# Altium schematic sheet 03-Power.SchDoc
size A
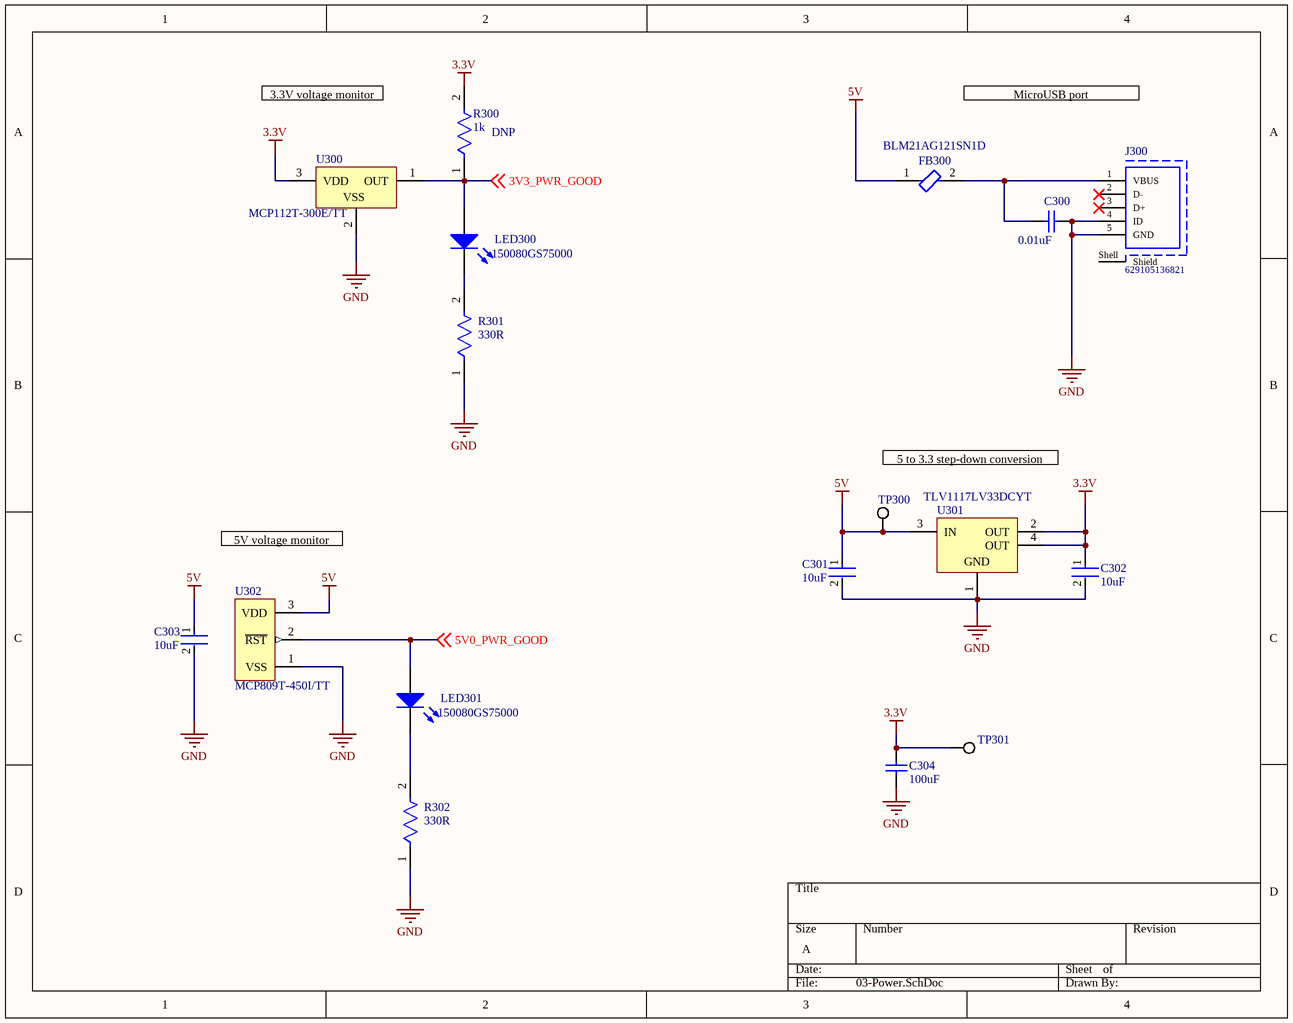
[diagram p0: 03-Power.SchDoc]

## Parts
C300  0.01uF  [CAPC2013X88X50LL20T25]
C301  10uF  [FP-GRM21B-0_1-IPC_B]
C302  10uF  [FP-GRM21B-0_1-IPC_B]
C303  10uF  [FP-GRM21B-0_1-IPC_B]
C304  100uF  [CAPC3216X190X55ML30T25]
FB300  BLM21AG121SN1D  [FP-BLM21-0_2-t0_85-e0_5-IPC_A]
J300  629105136821  [629105136821]
LED300  150080GS75000  [0805_A]
LED301  150080GS75000  [0805_A]
R300  1k  [FP-ERA6A-IPC_C]
R301  330R  [FP-ERA3A-MFG]
R302  330R  [FP-ERA3A-MFG]
TP300  5019  [KSTN-5019_V]  (value not drawn)
TP301  5019  [KSTN-5019_V]  (value not drawn)
U300  MCP112T-300E/TT  [SOT-23-TT3_L]
U301  TLV1117LV33DCYT  [DCY0004A_M]
U302  MCP809T-450I/TT  [SOT-23-TT3_N]

## Nets
3.3V: C302.1 C304.2 R300.2 TP301.1 U300.3(VDD) U301.2(OUT) U301.4(OUT)
5V: C301.1 C303.1 FB300.1 TP300.1 U301.3(IN) U302.3(VDD)
GND: C300.2 C301.2 C302.2 C303.2 C304.1 J300.4(ID) J300.5(GND) R301.1 R302.1 U300.2(VSS) U301.1(GND) U302.1(VSS)
3V3_PWR_GOOD: LED300.2(A) R300.1 U300.1(OUT) ; off-sheet 3V3_PWR_GOOD
5V0_PWR_GOOD: LED301.2(A) U302.2(~{RST}) ; off-sheet 5V0_PWR_GOOD
NetC300_1: C300.1 FB300.2 J300.1(VBUS)
NetLED300_1: LED300.1(K) R301.2
NetLED301_1: LED301.1(K) R302.2

Not connected (* = marked no-connect by the designer): J300 2(D-)* 3(D+)* Shell(Shield)

## Notes on the sheet
- 3.3V voltage monitor
- MicroUSB port
- (near R300) DNP
- 5 to 3.3 step-down conversion
- 5V voltage monitor

## Library data of the parts
C300 = CMP-2007-00266-1: Manufacturer: Kemet; Part Number: C0805C103K5RACTU; Capacitance: 10nF; Tolerance: 10%; Voltage Rating (DC): 50V; Dielectric: X7R; Supplier 1: Digi-Key; Supplier 2: Digi-Key; Manufacturer Part Number: C0805C103K5RACTU; RoHS: Yes; Category: Ceramic Capacitors; Stock 2: 3220156; Pricing 2: 1=0.11000, 10=0.07500, 50=0.04260, 100=0.03530, 500=0.02476, 1000=0.02050 (USD); Mount: Surface Mount; Case/Package: 0805; Case Code (Imperial): 0805; Case Code (Metric): 2012; Contact Plating: Tin,Matte; Min Operating Temperature: -55°C; Max Operating Temperature: 125°C; Packaging: Tape and Reel; Package Quantity: 4000; Voltage Rating: 50V; Termination: SMD/SMT; Voltage: 50V; Construction: Flat; Length: 2mm; Width: 1.2mm; Height: 0.78mm; Lead Pitch: 0.75mm; Depth: 1.25mm; Radiation Hardening: No; ComponentLink1URL: http://www.farnell.com/datasheets/2740682.pdf?src-supplier=Farnell; ComponentLink1Description: http://www.farnell.com/datasheets/2740682.pdf?src-supplier=Farnell; ComponentLink2URL: http://www.onlinecomponents.com/productFiles/mf-KEM/kem_c1002_x7r_smd.pdf?src-supplier=Onlinecomponents.com; ComponentLink2Description: http://www.onlinecomponents.com/productFiles/mf-KEM/kem_c1002_x7r_smd.pdf?src-supplier=Onlinecomponents.com; ComponentLink3URL: https://www.verical.com/server-webapp/html/getDatasheet?partID=293414&src-supplier=Verical; ComponentLink3Description: https://www.verical.com/server-webapp/html/getDatasheet?partID=293414&src-supplier=Verical; ComponentLink4URL: http://www.farnell.com/datasheets/2740682.pdf?src-supplier=Newark; ComponentLink4Description: http://www.farnell.com/datasheets/2740682.pdf?src-supplier=Newark; ComponentLink5URL: http://www.farnell.com/datasheets/2740682.pdf?src-supplier=Element14; ComponentLink5Description: http://www.farnell.com/datasheets/2740682.pdf?src-supplier=Element14; ComponentLink6URL: https://api.kemet.com/component-edge/download/datasheet/C0805C103K5RACTU.pdf?src-supplier=Digi-Key; ComponentLink6Description: https://api.kemet.com/component-edge/download/datasheet/C0805C103K5RACTU.pdf?src-supplier=Digi-Key; ComponentLink7URL: http://www.kemet.com/Lists/ProductCatalog/Attachments/53/KEM_C1002_X7R_SMD.pdf?src-supplier=Avnet; ComponentLink7Description: http://www.kemet.com/Lists/ProductCatalog/Attachments/53/KEM_C1002_X7R_SMD.pdf?src-supplier=Avnet
C301-C303 = CMP-2007-03503-2: Chip Multilayer Ceramic Capacitors for General Purpose, 0805, 10uF, X6S, 22%, 10%, 16V; Capacitance: 10uF; Termination: SMD/SMT; Min Operating Temperature: -55°C; REACH SVHC: No SVHC; Voltage: 16V; Thickness: 0.053inch; Voltage Rating (DC): 16V; Lead Free: Lead Free; Tolerance: 10%; Packaging: Tape and Reel; Package Quantity: 3000; Max Operating Temperature: 105°C; Height: 1.25mm; Case Code (Metric): 2012; Case Code (Imperial): 0805; Dielectric: X6S; Weight: 0.000335oz; Depth: 1.25mm; Width: 0.049inch; Voltage Rating: 16V; Case/Package: 0805; Mount: Surface Mount; Length: 2mm
C304 = CMP-1662-00011-2: Chip Capacitor, 100 uF, +/- 20%, 6.3 V, -55 to 85 degC, 1206 (3216 Metric), RoHS, Tape and Reel; PartNumber: GRM31CR60J107ME39L; Case\/Package: 1206; Voltage Rating (DC): 6.3 V; Type (Capacitors): X5R; REACH SVHC: No SVHC; Height: 1.6 mm; Tolerance: 20%; Packaging: Tape and Reel; Mount: Surface Mount; PackageDescription: 2-Pin Surface Mount Device, Body 3.2 x 1.6 mm; ComponentLink1URL: http://www.murata.com/; Pins: 2; ComponentLink2Description: Datasheet; PackageReference: 1206; Width: 1.6 mm; Package Quantity: 2000; Capacitance: 100 uF; Min Operating Temperature: -55 degC; Case Code (Imperial): 1206; Max Operating Temperature: 85 degC; DatasheetVersion: 09/2016; Mounting Technology: Surface Mount; Voltage Rating: 6.3 V; ComponentLink1Description: Manufacturer URL; Radiation Hardening: No; Case Code (Metric): 3216; Length: 3.2 mm; ComponentLink2URL: http://psearch.en.murata.com/capacitor/product/GRM31CR60J107ME39%23.pdf; RoHSCompliant: true
FB300 = CMP-0686-00716-3: FERRITE BEAD 120 OHM 0805 1LN; Number of Lines: 1; DC Resistance-Max: 100mR; Material: Steel; Max DC Current: 200mA; Shielding: Unshielded; Test Frequency: 100MHz; Impedance: 120R; Current Rating: 800mA; Max Current Rating: 1A; Resistance: 150mR; Tolerance: 25%; Width: 1.25mm; Number of Circuits: 1; Military Standard: Not; Height: 0.85mm; Series: BLM21A; Min Operating Temperature: -55°C; DC Resistance (DCR): 100mR; Termination: SMD/SMT; Core Material: Ferrite; REACH SVHC: No SVHC; Radiation Hardening: No; Max Operating Temperature: 125°C; Number of Pins: 2; Case/Package: 0805; Case Code (Imperial): 0805; Frequency: 100MHz; Depth: 1.25mm; Length: 2mm; DC Current: 200mA; Lead Free: Lead Free; Case Code (Metric): 2012; Package Quantity: 1; Packaging: Tape and Reel
J300 = CMP-1502-03253-1: Micro USB 2.0 Type B Receptacle WR-COM, Horizontal, SMT, with Pads and Pegs; Manufacturer: Wurth Elektronik; Contact Resistance: 30mOhm; Rated Current: 1A; Working Voltage: 30VAC; Datasheet URL: https://katalog.we-online.de/em/datasheet/629105136821.pdf; Mounting Technology: SMT; Publisher: WurthElektronik; Package Reference: 629105136821; Orientation: Horizontal; Packaging: TapeandReel; Part Number: 629105136821; Manufacturer URL: http://www.we-online.de; Connector Type: MicroUSB2.0TypeB; Gender: Receptacle; Operating Temperature: -40to105degC
LED300 LED301 = CMP-1426-00007-1: SMD mono-color Chip LED, WL-SMCW, Green; Manufacturer: Wuerth Elektronik; PackageReference: 0805_A; Color: Green; PartNumber: 150080GS75000; ComponentLink2URL: http://katalog.we-online.com/led/datasheet/150080GS75000.pdf; ComponentLink1URL: http://www.we-online.com; ComponentLink1Description: Manufacturer URL; ComponentLink2Description: Datasheet
R300 = CMP-2001-00581-2: RES 1K OHM 0.1% 1/8W 0805; Temperature Coefficient: 25ppm/°C; Resistance: 1kR; Working Voltage: 100V; Max Power Dissipation: 125mW; Height: 0.5mm; Technology: THIN FILM; REACH SVHC: No SVHC; Packaging: Tape and Reel; Length: 2mm; Width: 1.25mm; Resistance Tolerance: 0.1%; Series: ERA-6A; Resistor Type: Thin Film; Number of Pins: 2; Case Code (Metric): 2012; Voltage Rating: 100V; Radiation Hardening: No; Construction: Rectangular; Mount: Surface Mount; Number of Terminations: 2; Case/Package: 0805; Min Operating Temperature: -55°C; Military Standard: Not; RoHS Compliant: Yes; Termination: SMD/SMT; Case Code (Imperial): 0805; Depth: 1.25mm; Power Rating: 125mW; Max Operating Temperature: 155°C; Contact Plating: Tin; Package Quantity: 5000; Tolerance: 0.1%
R301 R302 = CMP-2000-00036-2: RES SMD 330 OHM 0.1% 1/10W 0603; Power Rating: 100mW; Temperature Coefficient: 25ppm/°C; Voltage Rating: 75V; Package Quantity: 1; Case Code (Metric): 1608; Size Code: 0603; Construction: Rectangular; Width: 0.8mm; Number of Pins: 2; Case/Package: 0603; Height: 0.45mm; Resistor Type: Thin Film; Resistance: 330R; RoHS Compliant: Yes; Contact Plating: Tin; Case Code (Imperial): 0603; Number of Terminations: 2; Tolerance: 0.1%; Min Operating Temperature: -55°C; Mount: Surface Mount; Length: 1.6mm; Packaging: Tape and Reel; Resistance Tolerance: 0.1%; Military Standard: Not; Reach SVHC Compliant: Yes; Max Operating Temperature: 155°C; Features: Automotive AEC-Q200; Termination: SMD/SMT; Max Power Dissipation: 100mW; Radiation Hardening: No; Depth: 0.8mm; Series: ERA-3A; Technology: METAL FILM
TP300 TP301 = CMP-1672-00008-1: Test Point, 1 Position SMD, RoHS, Tape and Reel; Manufacturer 1: Keystone Electronics; ComponentLink1Description: Manufacturer URL; Package Quantity: 1000; DatasheetVersion: 03/2014; Packaging: Tape and Reel; ComponentLink2URL: http://www.keyelco.com/product-pdf.cfm?p=1357; ComponentLink1URL: http://www.keyelco.com/; Mount: Surface Mount; Contact Plating: Silver; PackageDescription: 1-Pin Surface Mount Device, Body 3.81 x 2.03 mm; Pins: 1; RoHSCompliant: True; Mounting Technology: Surface Mount; ComponentLink2Description: Datasheet; PackageReference: 5019; Supplier 1: Digi-Key; Supplier Part Number 1: 36-5019CT-ND; Manufacturer Part Number 1: 5019; RoHS: Yes; Category: Connectors; Stock 1: 1316816; Pricing 1: 1=0.34000, 25=0.27360, 100=0.22340, 250=0.20064, 500=0.19152 (USD); Number of Pins: 1; Material: Bronze; Contact Material: Bronze; Series: 5019; Termination: SMD/SMT; Height: 0.09inch; RoHS Compliant: Yes; REACH SVHC: No SVHC; Lead Free: Lead Free; ComponentLink3URL: https://datasheet.ciiva.com/16318/m60-2p61-16318395.pdf?src-supplier=Future+Electronics; ComponentLink3Description: https://datasheet.ciiva.com/16318/m60-2p61-16318395.pdf?src-supplier=Future+Electronics; ComponentLink4URL: https://datasheet.ciiva.com/16885/70182998-16885945.pdf?src-supplier=Allied+Electronics; ComponentLink4Description: https://datasheet.ciiva.com/16885/70182998-16885945.pdf?src-supplier=Allied+Electronics; ComponentLink5URL: https://datasheet.ciiva.com/14848/m60-2p61-14848437.pdf?src-supplier=Digi-Key; ComponentLink5Description: https://datasheet.ciiva.com/14848/m60-2p61-14848437.pdf?src-supplier=Digi-Key; ComponentLink6URL: https://datasheet.ciiva.com/14848/m60-2p61-14848438.pdf?src-supplier=Digi-Key; ComponentLink6Description: https://datasheet.ciiva.com/14848/m60-2p61-14848438.pdf?src-supplier=Digi-Key; ComponentLink7URL: https://datasheet.ciiva.com/14848/m60-2p61-14848439.pdf?src-supplier=Digi-Key; ComponentLink7Description: https://datasheet.ciiva.com/14848/m60-2p61-14848439.pdf?src-supplier=Digi-Key
U300 = CMP-0130-00043-1: 1.75Î¼A Micropower Voltage Detector, Push-Pull Output, 2.93V, 3-Pin SOT-23, Extended Temperature, Tape and Reel; Code_IPC: SOT23-3; DatasheetVersion: revD, Jun-2005; PackageVersion: revBB, Aug-2009; PackageDescription: 3-Lead Plastic Small Outline Transistor (TT) [SOT-23]; PackageReference: SOT-23-TT3
U301 = CMP-0395-00499-2: Single Output LDO, 1 A, Fixed 3.3 V Output, 2 to 5.5 V Input, 4-pin SOT-223 (DCY), -40 to 125 degC, Green (RoHS & no Sb/Br); Manufacturer: Texas Instruments; Vout Adj(Max)(V): 3.3; Iout(Max)(A): 1; SubFamily: Single Channel LDO; Iq(Typ)(mA): 0.05; Accuracy(%): 2; Vin(Max)(V): 5.5; Vdo(Typ)(mV): 1200; PartNumber: TLV1117LV33DCYT; PackageReference: DCY0004A; PackageVersion: 4202506/B; ComponentLink1URL: http://www.ti.com/; DatasheetVersion: SBVS160A; Mounting Technology: Surface Mount; Fixed Output Options(V): 3.3; ComponentLink3Description: Package Specification; PackageDescription: 4-Pin Plastic Small Outline, Body 3.5 x 6.5 mm, Pitch 2.3 mm; Vout Adj(Min)(V): 3.3; ComponentLink2URL: http://www.ti.com/general/docs/lit/getliterature.tsp?genericPartNumber=TLV1117LV33&fileType=pdf; Code_JEDEC: TO-261; ComponentLink1Description: Manufacturer URL; Vin(Min)(V): 2; ComponentLink2Description: Datasheet; Eco-Plan: Green (RoHS & no Sb/Br); ComponentLink3URL: http://www.ti.com/litv/pdf/mpds094a
U302 = CMP-0138-00383-1: Microcontroller Supervisory Circuit with Push-Pull Output, 3-Pin SOT-23, Industrial Temperature, Tape and Reel; DatasheetVersion: revC, 2001; PackageReference: SOT-23-TT3; Code_IPC: SOT23-3; PackageVersion: revBB, Aug-2009; PackageDescription: 3-Lead Plastic Small Outline Transistor (TT) [SOT-23]